# Altium schematic sheet WorkplaceSaferyDevice_Schematic.SchDoc
size C
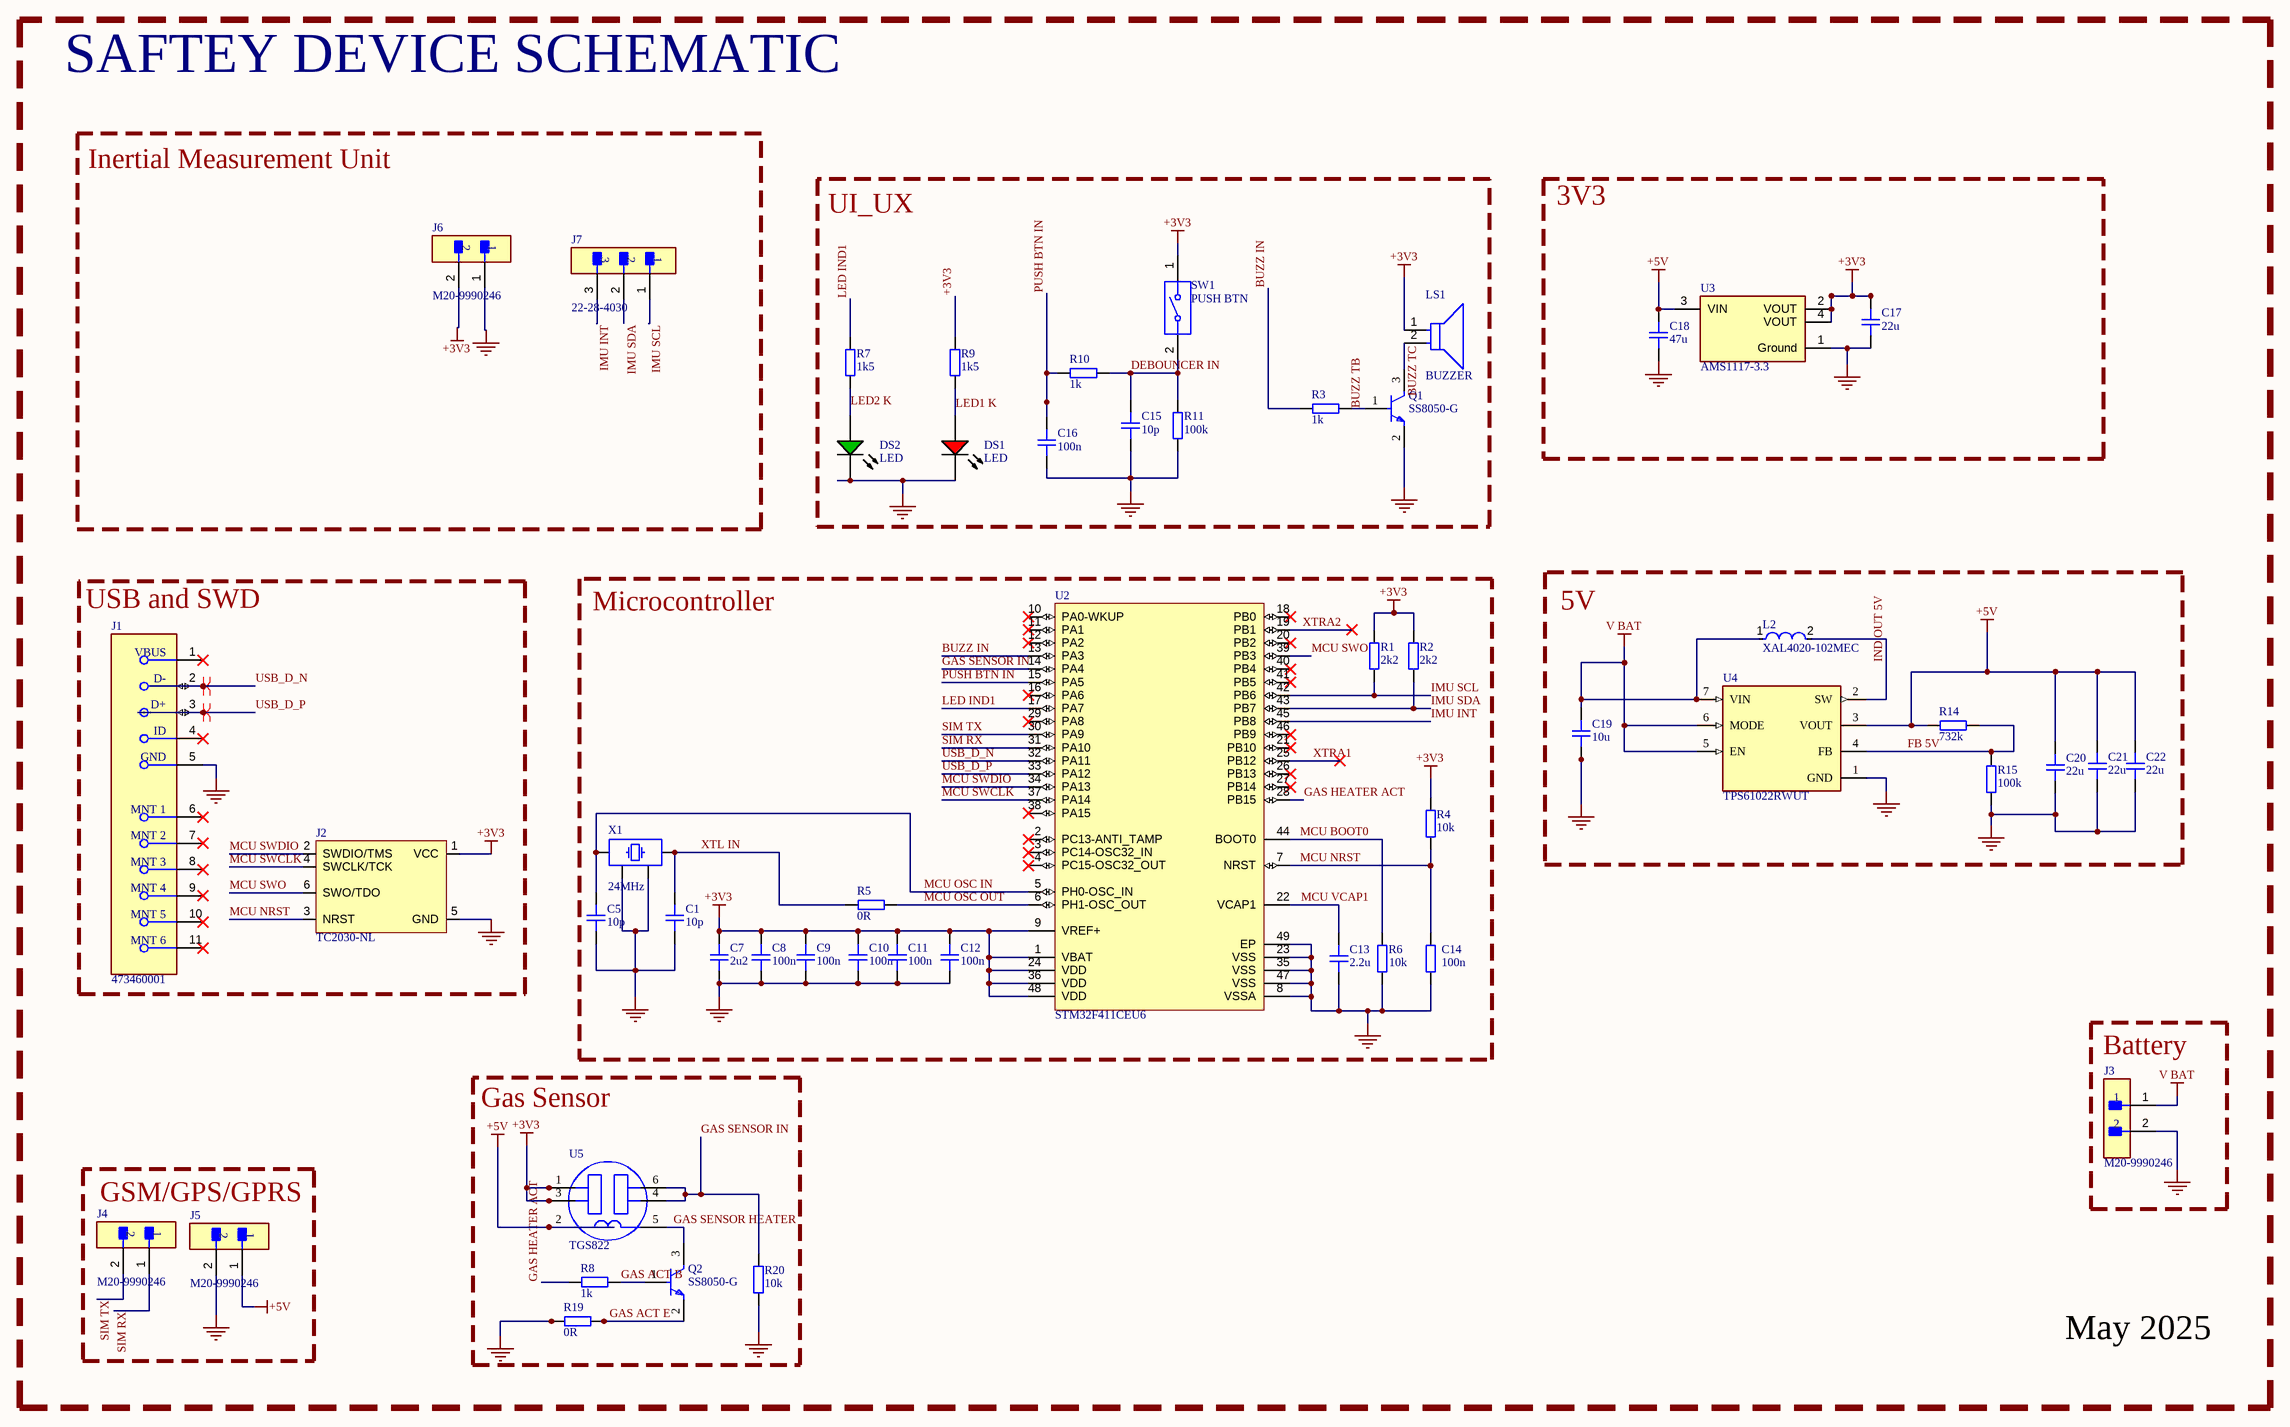
[diagram p0: WorkplaceSaferyDevice_Schematic.SchDoc]

## Parts
C1  10p  [CAP_0603]
C5  10p  [CAP_0603]
C7  2u2  [CAP_0805]
C8  100n  [CAP_0603]
C9  100n  [CAP_0603]
C10  100n  [CAP_0603]
C11  100n  [CAP_0603]
C12  100n  [CAP_0603]
C13  2.2u  [CAP_0603]
C14  100n  [RES_0603]
C15  10p  [CAP_0805]
C16  100n  [CAP_0805]
C17  22u  [CAP_1206]
C18  47u  [CAP_0805]
C19  10u  [CAP_0805]
C20  22u  [CAP_1206]
C21  22u  [CAP_1206]
C22  22u  [CAP_1206]
DS1  LED  [LTST-C191KRKT_V]
DS2  LED  [LTST-C190GKT_V]
J1  473460001  [FP-473460001-MFG]
J2  TC2030-NL  [TC2030-NL-FP]  (no BOM)
J3  M20-9990246  [FP-M20-9990246-MFG]  (no BOM)
J4  M20-9990246  [FP-M20-9990246-MFG]  (no BOM)
J5  M20-9990246  [FP-M20-9990246-MFG]  (no BOM)
J6  M20-9990246  [FP-M20-9990246-MFG]  (no BOM)
J7  22-28-4030  [FP-22-28-4030-MFG]  (no BOM)
L2  XAL4020-102MEC  [FP-XAL4020-102MEC-MFG]
LS1  BUZZER  [FP-PS1440P02BT-MFG]  (no BOM)
Q1  SS8050-G  [FP-SS8050-G-MFG]
Q2  SS8050-G  [FP-SS8050-G-MFG]
R1  2k2  [RES_0603]
R2  2k2  [RES_0603]
R3  1k  [RES_0805]
R4  10k  [RES_0603]
R5  0R  [RES_0603]
R6  10k  [RES_0603]
R7  1k5  [RES_0805]
R8  1k  [RES_0805]
R9  1k5  [RES_0805]
R10  1k  [RES_0805]
R11  100k  [RES_0805]
R14  732k  [RES_0603]
R15  100k  [RES_0603]
R19  0R  [RES_0805]
R20  10k  [RES_0805]
SW1  PUSH BTN  [CHRY-MX1A-11NW_V]  (no BOM)
U2  STM32F411CEU6  [STM-UFQFPN48_L]
U3  AMS1117-3.3  [FP-AMS1117-IPC_C]
U4  TPS61022RWUT  [FP-RWU0007A-MFG]
U5  TGS822  [FP-TGS822-MFG]  (no BOM)
X1  24MHz  [XTAL_3225]

## Blocks framed on the sheet
Inertial Measurement Unit: J6 J7
UI_UX: C15 C16 DS1 DS2 LS1 Q1 R3 R7 R9-R11 SW1
3V3: C17 C18 U3
USB and SWD: J1 J2
Microcontroller: C1 C5 C7-C14 R1 R2 R4-R6 U2 X1
5V: C19-C22 L2 R14 R15 U4
Battery: J3
Gas Sensor: Q2 R8 R19 R20 U5
GSM/GPS/GPRS: J4 J5

## Nets
+3V3: C7.2 C8.2 C9.2 C10.2 C11.2 C12.2 C17.2 J2.1(VCC) J6.2 LS1.1 R1.1 R2.1 R4.1 R9.1 SW1.1 U2.1(VBAT) U2.9(VREF+) U2.24(VDD) U2.36(VDD) U2.48(VDD) U3.2(VOUT) U3.4(VOUT) U5.1(VC) U5.3(VC)
+5V: C18.2 C20.2 C21.2 C22.2 J5.1 R14.1 U3.3(VIN) U4.3(VOUT) U5.2(VH)
GND: C1.1 C5.1 C7.1 C8.1 C9.1 C10.1 C11.1 C12.1 C13.1 C14.1 C15.1 C16.1 C17.1 C18.1 C19.1 C20.1 C21.1 C22.1 DS1.2(K) DS2.2(K) J1.5(GND) J2.5(GND) J3.2 J5.2 J6.1 Q1.2(E) R6.2 R11.1 R15.1 R19.1 R20.2 U2.8(VSSA) U2.23(VSS) U2.35(VSS) U2.47(VSS) U2.49(EP) U3.1(Ground) U4.1(GND) X1.2 X1.4
V BAT: C19.2 J3.1 L2.1 U4.5(EN) U4.6(MODE) U4.7(VIN)
BUZZ IN: R3.2 U2.13(PA3)
BUZZ TB: Q1.1(B) R3.1
BUZZ TC: LS1.2 Q1.3(C)
DEBOUNCER IN: C15.2 R10.1 R11.2 SW1.2
FB 5V: R14.2 R15.2 U4.4(FB)
GAS ACT B: Q2.1(B) R8.1
GAS ACT E: Q2.2(E) R19.2
GAS HEATER ACT: R8.2 U2.28(PB15)
GAS SENSOR HEATER: Q2.3(C) U5.5(GND)
GAS SENSOR IN: R20.1 U2.14(PA4) U5.4(VRL) U5.6(VRL)
IMU INT: J7.3 U2.45(PB8)
IMU SCL: J7.1 R1.2 U2.42(PB6)
IMU SDA: J7.2 R2.2 U2.43(PB7)
IND OUT 5V: L2.2 U4.2(SW)
LED1 K: DS1.1(A) R9.2
LED2 K: DS2.1(A) R7.2
LED IND1: R7.1 U2.17(PA7)
MCU BOOT0: R6.1 U2.44(BOOT0)
MCU NRST: C14.2 J2.3(NRST) R4.2 U2.7(NRST)
MCU OSC IN: C5.2 U2.5(PH0-OSC_IN) X1.1
MCU OSC OUT: R5.2 U2.6(PH1-OSC_OUT)
MCU SWCLK: J2.4(SWCLK/TCK) U2.37(PA14)
MCU SWDIO: J2.2(SWDIO/TMS) U2.34(PA13)
MCU SWO: J2.6(SWO/TDO) U2.39(PB3)
MCU VCAP1: C13.2 U2.22(VCAP1)
PUSH BTN IN: C16.2 R10.2 U2.15(PA5)
SIM RX: J4.1 U2.31(PA10)
SIM TX: J4.2 U2.30(PA9)
USB_D_N: J1.2(D-) U2.32(PA11)
USB_D_P: J1.3(D+) U2.33(PA12)
XTL IN: C1.2 R5.1 X1.3
XTRA1: U2.25(PB12)
XTRA2: U2.19(PB1)

Not connected (* = marked no-connect by the designer): J1 1(VBUS)* 4(ID)* 6(MNT_1)* 7(MNT_2)* 8(MNT_3)* 9(MNT_4)* 10(MNT_5)* 11(MNT_6)*; U2 2(PC13-ANTI_TAMP)* 3(PC14-OSC32_IN)* 4(PC15-OSC32_OUT)* 10(PA0-WKUP)* 11(PA1)* 12(PA2)* 16(PA6)* 18(PB0)* 20(PB2)* 21(PB10)* 26(PB13)* 27(PB14)* 29(PA8)* 38(PA15)* 40(PB4)* 41(PB5)* 46(PB9)*

## Layout directives
differential pair; differential pair class DIFF_USB: USB_D_N, USB_D_P

## Notes on the sheet
- SAFTEY DEVICE SCHEMATIC
- May 2025
- DWG. NO.
- REV.
- SHT.
- THIS DOCUMENT AND THE DATA DISCLOSED HEREIN OR HEREWITH IS THE PROPERTY OF ALTIUM LIMITED AND MAY BE FREELY DISTRIBUTED IN WHOLE. NO RIGHTS ARE RESERVED OR EXPRESS OR IMPLIED WARANTEE GIVEN.
- REVISION
- DESCRIPTION
- DATE
- APPROVED
- ENG:
- APPROVALS
- PROJECT
- DSN:
- CHK:
- REFERENCE DOCUMENTS
- PROJECT REVISION:
- TITLE
- DOCUMENT REVISION:
- DESIGN ITEM:
- BOM:
- FAB DWG:
- PCB DWG:
- ASSY DWG:
- SCALE:
- SIZE
- B
- CAGE CODE
- FILE NAME
- DWG NO.
- SHEET
- OF
- REV

## Library data of the parts
C1 C5 C8-C12 = CAP_0603: Capacitor SMD 0603; Manufacturer: *; Manufacturer Part Number: *; Distributor Link: *; LCSC: *; Rating: *; Dielectric: *
C7 C15 C16 = CAP_0805: Capacitor SMD 0805; Manufacturer: *; Manufacturer Part Number: *; Distributor Link: *; LCSC: *; Rating: *; Dielectric: *
C13 = CAP_0603: Ceramic Capacitor, Multilayer, Ceramic, 16V, 10% +Tol, 10% -Tol, X5R, 15% TC, 2.2uF, Surface Mount, 0603; Multilayer: Yes; Manufacturer: *; Manufacturer Part Number: *; Distributor Link: *; LCSC: *; Rating: *; Dielectric: *; Supplier: Arrow Electronics; Supplier Part Number: C0603C225K4PACTU; RoHS: Yes; Category: Ceramic Capacitors; Stock: 244000; Pricing: 4000=0.021, 8000=0.02 (USD); Mounting Technology: Surface Mount; Pins: 2; Dielectric Material: Ceramic; Package Shape: Rectangular; Case/Package: 0603; Terminal Finish: Nickel; Min Operating Temperature: -55°C; Max Operating Temperature: 85°C; JESD-609 Code: e3; Value: 2.2uF; Capacitor Type: Ceramic; Tolerance  (fill in as +-): 10%; Package Style: SMTMeter; Packaging: Tape and Reel; Tolerance (fill in as +-): 10%; Rated DC Voltage (URdc): 16V; Temperature Characteristics Code: X5R; Termination: Wraparound; Length: 1.6mm; Width: 0.8mm; Height: 0.8mm; Reach SVHC Compliant: Yes; RoHS Compliant: Yes; ComponentLink1URL: https://datasheet.ciiva.com:443/pdfs/VipMasterIC/IC/KEME/KEME-S-A0008991665/KEME-S-A0008991665-1.pdf?src-supplier=IHS+Markit; ComponentLink1Description: https://datasheet.ciiva.com:443/pdfs/VipMasterIC/IC/KEME/KEME-S-A0008991665/KEME-S-A0008991665-1.pdf?src-supplier=IHS+Markit
C14 R1 R2 R4-R6 = RES_0603: Resistor SMD 0603; Manufacturer: *; Manufacturer Part Number: *; Distributor Link: *; LCSC: *
C17 C20-C22 = CAP_1206: Capacitor SMD 1206; Manufacturer: *; Manufacturer Part Number: *; Distributor Link: *; LCSC: *; Rating: *; Dielectric: *
C18 C19 = CAP_0805: Capacitor SMD 0805 / suggested: / GRM21BR61E106MA73L; Manufacturer: *; Manufacturer Part Number: *; Distributor Link: *; LCSC: *; Rating: *; Dielectric: *
DS1 = CMP-007-00024-2: LED Uni-Color Red, 62.5 mW, 25 mA, -30 to 85 degC, 2-Pin SMD, RoHS, Tape and Reel; Manufacturer: Lite-On; Power: 75mW; Forward Voltage: 2V; Luminous Intensity: 54mcd; Lens Style: Diffused; Viewing Angle: 130degrees; Forward Current: 20mA; Manufacturer URL: http://www.us.liteon.com/; Case/Package: 0603; Datasheet Version: Rev. F, 05/2013; Package Reference: C191KRKT; Datasheet URL: http://optoelectronics.liteon.com/upload/download/DS-22-99-0151/S_110_LTST-C190KRKT.pdf; Package Description: 2-Pin Surface Mount Device, Body 1.6 x 0.8 mm; Nominal Vf: 2V; Packaging: TapeandReel; RoHS Compliant: True; Pins: 2; Illumination Colour: Red; Colour: Red; Mounting Technology: SM; Package Quantity: 3000; Min Operating Temperature: -55°C; Max Operating Temperature: 85°C
DS2 = CMP-007-00022-2: LED Uni-Color Green, 100 mW, 30 mA, -55 to 85 degC, 2-Pin SMD, RoHS, Tape and Reel; Manufacturer: Lite-On; Power: 100mW; Forward Voltage: 2.1V; Viewing Angle: 130degrees; Forward Current: 20mA; Luminous Intensity: 6mcd; Lens Style: Clear; Manufacturer URL: http://www.us.liteon.com/; RoHS Compliant: True; Colour: Green; Package Description: 2-Pin Surface Mount Device, Body 1.6 x 0.8 mm; Datasheet URL: http://datasheet.octopart.com/LTST-C190GKT-Lite-On-datasheet-158530.pdf; Datasheet Version: Dec-06; Mounting Technology: SM; Case/Package: 0603; Package Reference: C190GKT; Packaging: TapeandReel; Min Operating Temperature: -55°C; Nominal Vf: 2.1V; Package Quantity: 3000; Illumination Colour: Green; Max Operating Temperature: 85°C; Pins: 2
J1 = CMP-2000-05246-2: CONN RCPT USB2.0 MICRO B SMD R/A; Manufacturer: Molex; Conn Orientation: Right Angle; Is Female: yes; Shielding: true; Pitch: 0.65mm; Number Of Contacts: 5; Voltage Rating: 30V; Current Rating: 1.8A; Device Class L2: USB Connectors; Digikey Description: CONN RCPT USB2.0 MICRO B SMD R/A; Height: 2.945mm; RoHS: TRUE; ComponentLink2Description: Datasheet; Octopart: https://octopart.com/47346-0001-molex-7164928; Automotive: No; Package: 0; Category: Conn; Device Class L1: Connectors; Usb Standard: USB 2.0; Temperature: -30°C to +85°C; Temperature Range Low: -30°C; Footprint Url: https://www.molex.com/pdm_docs/sd/473460001_sd.pdf; ComponentLink2URL: https://www.molex.com/webdocs/datasheets/pdf/en-us/0473460001_IO_CONNECTORS.pdf; Lead Free: Yes; Manufacturer Part Number: 473460001; Contact Material: Gold,Nickel; Temperature Range High: +85°C; Device Class L3: unset
J2 = TC2030-NL: Tag-Connect No-Solder SWD Debug Connector (No Legs) DO NOT PLACE; Manufacturer: Tag-Connect; Manufacturer Part Number: TC2030-NL-FP
J3-J6 = CMP-15831-000009-1: CONN HEADER VERT 2POS 2.54MM; Manufacturer: Harwin; Conn Gender: Male; Conn Orientation: Vertical; Number Of Contacts: 2; Current Rating: 3A; ComponentLink2URL: https://cdn.harwin.com/pdfs/M20-999.pdf; ComponentLink2Description: Datasheet; Package: M20-9990246; Temperature: -40°C to +105°C; Octopart: https://octopart.com/m20-9990246-harwin-2590635; Mouser Description: 2.54mm (0.1") Pitch SIL Vertical PC Tail Pin Header, 6.1mm mating pin height, tin, 2 contacts; Temperature Range High: +105°C; Device Class L1: Connectors; RoHS: TRUE; Automotive: No; Height: 8.99mm; Number Of Rows: 1; Contact Material: Tin,Nickel; Category: Conn; Pitch: 2.54mm; Lead Free: Yes; Digikey Description: CONN HEADER VERT 2POS 2.54MM; Manufacturer Part Number: M20-9990246; Temperature Range Low: -40°C; Device Class L3: unset; Device Class L2: Headers and Wire Housings
J7 = CMP-04776-000098-1: CONN HEADER VERT 3POS 2.54MM; Manufacturer: Molex; Conn Orientation: Vertical; Conn Gender: Male; Current Rating: 4A; Voltage Rating: 500V; Number Of Contacts: 3; Category: Conn; Number Of Rows: 1; Manufacturer Part Number: 22-28-4030; RoHS: TRUE; Package: 22-28-4030; Footprint Url: https://www.molex.com/pdm_docs/sd/022284030_sd.pdf; ComponentLink2Description: Datasheet; Device Class L2: Headers and Wire Housings; Automotive: No; Temperature Range Low: -40°C; Digikey Description: CONN HEADER VERT 3POS 2.54MM; Mouser Description: Headers & Wire Housings 3P VERT HEADER Sn; Contact Material: Gold,Nickel; Pitch: 2.54mm; Device Class L1: Connectors; Lead Free: Yes; Device Class L3: unset; Temperature Range High: +80°C; Octopart: https://octopart.com/0022284030-molex-10476094; ComponentLink2URL: https://www.molex.com/webdocs/datasheets/pdf/en-us/0022284030_PCB_HEADERS.pdf; Height: 8.88mm; Temperature: -40°C to +80°C
L2 = CMP-11268-000037-1: Fixed Inductors 1uH 20% 9.6A 14.60mOhms AEC-Q200; Manufacturer: Coilcraft; Saturation Current: 8.7A; Core Material: Composite; Test Frequency: 1MHz; Standoff Height: 0.1mm; Shielding: true; Automotive Grade: Grade 1; Self Resonant Frequency: 79MHz; Series Resistance: 14.6mΩ; Rms Current: 9.6A; Category: Ind; RoHS: TRUE; Device Class L2: Inductors; Mouser Description: Power inductor, shielded, 20% tol, SMT, RoHS, halogen f; Lead Free: Yes; Device Class L1: Passive Components; Inductance: 1uH; ComponentLink2URL: https://www.coilcraft.com/pdfs/xal4000.pdf; Height: 2.1mm; Device Class L3: Fixed Inductors; Composition: Wirewound; Package: 0; Ambient Temperature Range Low: -40°C; Automotive: Yes; Ambient Temperature Range High: +125°C; ComponentLink2Description: Datasheet; Octopart: https://octopart.com/xal4020-102mec-coilcraft-13142161; Tolerance: 20%; Value: 1uH; Manufacturer Part Number: XAL4020-102MEC
LS1 = CMP-08413-000003-1: AUDIO PIEZO TRANSDUCER 30V TH; Self Resonant Frequency: 4kHz; Washable: No; Voltage Rating (DC): 3V; Number of Terminals/Pins: 2; Packaging: Tape and Reel; Lead Free: Lead Free; Min Operating Temperature: -10°C; Package Quantity: 350; Termination: PC Pins; Mount: Through Hole; Max Operating Temperature: 70°C; Operating Supply Voltage: 3V; Diameter: 14mm; RoHS Compliant: Yes; Frequency: 4kHz; Height: 8mm
Q1 Q2 = CMP-20235-000001-1: NPN TRANSISTOR 1.5A 40V SOT-23 R; Transition Frequency: 100MHz; Max Breakdown Voltage: 25V; Collector Emitter Voltage (VCEO): 400mV; Max Power Dissipation: 300mW; Max Collector Current: 1.5A; Case/Package: TO-236-3; Packaging: Tape and Reel; RoHS Compliant: Yes; Mount: Surface Mount; Collector Emitter Breakdown Voltage: 25V
R3 R7-R11 R19 R20 = RES_0805: Resistor SMD 0805; Manufacturer: *; Manufacturer Part Number: *; Distributor Link: *; LCSC: *
R14 R15 = RES_0603: Resistor SMD 0603 / 100mW 1%; Manufacturer: *; Manufacturer Part Number: *; Distributor Link: *; LCSC: *
SW1 = CMP-2000-06786-1: Keylock Switch, 12 V, -10 to 70 degC, 2-Pin THD, RoHS, Bulk; Manufacturer: Cherry; Part No: MX1A11NW; Maximum DC Voltage Rating: 12V; COO: UK; Row Spacing: 6.35mm; Pole Throw Configuration: SPST; Total Travel: 4.06mm; Illumination Type: N/R; Actuator Style: Button; Operating Force: 0.58N; Electrical Life: 50000000Cycle; Minimum Insulation Resistance: 100MOhm; Body Orientation: Straight; Actuator Length: 3.6mm; Switch Configuration: N.O.; Maximum Current Rating: 0.01A; Maximum Contact Resistance: 200mOhm; Actuator Color: N/A; Terminal Type: PCPins; Operating Temperature: -10to70C; Number of Terminals: 2; Operating Speed: N/A; Maximum AC Voltage Rating: 12V; Housing Material: N/A; Datasheet URL: https://cdn.sparkfun.com/datasheets/Components/Switches/MX%20Series.pdf; Type: DesktopProfile; Terminal Pitch: 2.54mm; Package Reference: MX1A-11NW; ECCN: EAR99; Family: MX; Packaging: N/A; HTS: 8536509065; Actuator Material: N/A; Package Description: 2-Pin Through Hole Device, Body 15.6 x 15.6 mm; Dielectric Strength: N/A; Illumination Color: N/R; Manufacturer URL: http://cherryswitches.com/cn/; Dimension: 15.6x15.6x15.2mm; Mechanical Life: N/A; RoHS: Unknown; Contact Plating: N/A; Supplier: CherryElectrical; Contact Material: Silver/Gold; IP Rating: N/A; Mounting: ThroughHole; Datasheet Version: 09/2000; Maximum Power Rating: N/A; Mounting Technology: ThroughHole
U2 = CMP-0243-00165-1: ARM Cortex-M4 32-bit MCU+FPU, 512 KB Flash, 128 KB RAM, 36 I/Os, 48-Pin UFQFPN, -40 to 85 degC, Tray; Operating Frequency(F) (Processor speed) (MHz): 100; FLASH Size (Prog) (kB): 512; Internal RAM Size (kB): 128; I/Os (High Current): 36; Supply Voltage(Vcc) min (V): 1.7; Package Reference: 48-Pin Ultra Thin Fine Pitch Quad Flat No-Lead, 7 x 7 x 0.6 mm Body, 0.5 mm Pitch, Exposed Pad; ComponentLink1Description: Manufacturer URL; ComponentLink1URL: http://www.st.com/; Packing: Tray; Package Description: UFQFPN48; Core: ARM Cortex-M4; ComponentLink2Description: Datasheet; ComponentLink2URL: http://www.st.com/st-web-ui/static/active/en/resource/technical/document/datasheet/DM00115249.pdf; DatasheetVersion: Rev. 6; Mounting Technology: Surface Mount
U3 = CMP-209535-000001-1: LDO Voltage Regulators 1A, 3.3V; Manufacturer: Advanced Monolithic Systems; Dropout Voltage: 1.1V; Output Type: Fixed; Nominal Supply Current: 5mA; Max Power Dissipation: 1.2W; Max Supply Voltage: 15V; Number Of Outputs: 1; Standoff Height: 0.64mm; Max Junction Temp: +125°C; Height: 1.8mm; Package: AMS1117; Device Class L2: Power Management ICs; ComponentLink2Description: Datasheet; ComponentLink2URL: http://www.advanced-monolithic.com/pdf/ds1117.pdf; Category: IC; RoHS: TRUE; Automotive: No; Device Class L1: Integrated Circuits (ICs); Output Current: 1A; Device Class L3: Voltage Regulators - Linear; Temperature: -40°C to +125°C; Output Voltage: 3.3V; Manufacturer Part Number: AMS1117-3.3; Temperature Range Low: -40°C; Octopart: https://octopart.com/ams1117-3.3-advanced+monolithic+systems-25899300; Lead Free: Yes; Ipc Land Pattern Name: SOT229P700X180-4; Temperature Range High: +125°C
U4 = CMP-04918-000300-1: POWER MANAGEMENT
U5 = CMP-04312-24208239-1: TGS822 MOS-Type organic solvent vapors sensor; range: 50-5000ppm C2H5OH; supply: 5V; power: 660mW; Max Supply Voltage: 24V; NexarPartId: 24208239; Height: 10mm; RoHS: Compliant; Case/Package: Radial
X1 = TSX-3225_24.0000MF15X-AC: Crystal SMD 24MHz 10PPM 7pF 3225; Manufacturer: Epson; Manufacturer Part Number: TSX-3225 24.0000MF15X-AC